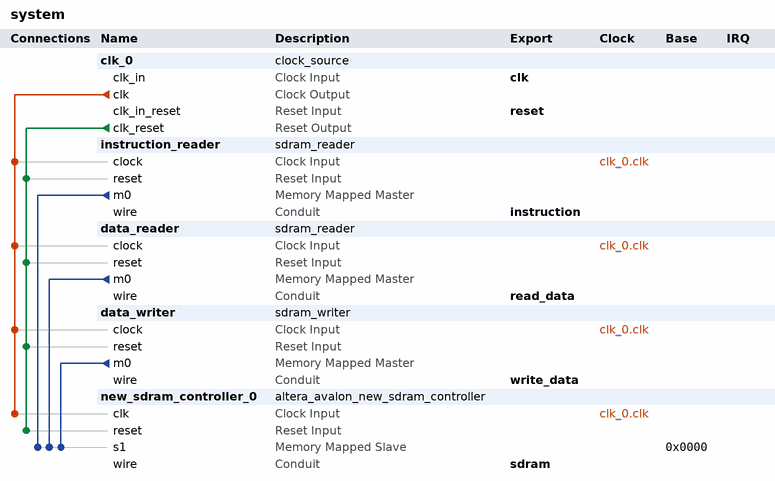
[diagram p0: system contents]
# Platform Designer (Qsys) system system, Cyclone IV E EP4CE22F17C6
# Parameters at their usual value, and those the tool derives, are not listed.
package require -exact qsys 15.1
create_system system
set_project_property DEVICE_FAMILY {Cyclone IV E}
set_project_property DEVICE EP4CE22F17C6

add_instance clk_0 clock_source 15.1
set_instance_parameter_value clk_0 clockFrequency 50000000

add_instance instruction_reader sdram_reader 1.0

add_instance data_reader sdram_reader 1.0

add_instance data_writer sdram_writer 1.0

add_instance new_sdram_controller_0 altera_avalon_new_sdram_controller 15.1
set_instance_parameter_value new_sdram_controller_0 TAC 5.5
set_instance_parameter_value new_sdram_controller_0 TRCD 20.0
set_instance_parameter_value new_sdram_controller_0 TRP 20.0
set_instance_parameter_value new_sdram_controller_0 casLatency 3
set_instance_parameter_value new_sdram_controller_0 columnWidth 9
set_instance_parameter_value new_sdram_controller_0 dataWidth 16
set_instance_parameter_value new_sdram_controller_0 generateSimulationModel false
set_instance_parameter_value new_sdram_controller_0 model single_Micron_MT48LC4M32B2_7_chip
set_instance_parameter_value new_sdram_controller_0 numberOfBanks 4
set_instance_parameter_value new_sdram_controller_0 numberOfChipSelects 1
set_instance_parameter_value new_sdram_controller_0 powerUpDelay 100.0
set_instance_parameter_value new_sdram_controller_0 refreshPeriod 15.625
set_instance_parameter_value new_sdram_controller_0 rowWidth 13

# connections
add_connection clk_0.clk data_reader.clock clock
add_connection clk_0.clk data_writer.clock clock
add_connection clk_0.clk instruction_reader.clock clock
add_connection clk_0.clk new_sdram_controller_0.clk clock
add_connection clk_0.clk_reset data_reader.reset reset
add_connection clk_0.clk_reset data_writer.reset reset
add_connection clk_0.clk_reset instruction_reader.reset reset
add_connection clk_0.clk_reset new_sdram_controller_0.reset reset
add_connection data_reader.m0 new_sdram_controller_0.s1 avalon
set_connection_parameter_value data_reader.m0/new_sdram_controller_0.s1 baseAddress 0x0000
add_connection data_writer.m0 new_sdram_controller_0.s1 avalon
set_connection_parameter_value data_writer.m0/new_sdram_controller_0.s1 baseAddress 0x0000
add_connection instruction_reader.m0 new_sdram_controller_0.s1 avalon
set_connection_parameter_value instruction_reader.m0/new_sdram_controller_0.s1 baseAddress 0x0000

# exported interfaces
add_interface clk clock sink
set_interface_property clk EXPORT_OF clk_0.clk_in
add_interface instruction conduit end
set_interface_property instruction EXPORT_OF instruction_reader.wire
add_interface read_data conduit end
set_interface_property read_data EXPORT_OF data_reader.wire
add_interface reset reset sink
set_interface_property reset EXPORT_OF clk_0.clk_in_reset
add_interface sdram conduit end
set_interface_property sdram EXPORT_OF new_sdram_controller_0.wire
add_interface write_data conduit end
set_interface_property write_data EXPORT_OF data_writer.wire

set_interconnect_requirement {$system} qsys_mm.clockCrossingAdapter AUTO
set_interconnect_requirement {$system} qsys_mm.insertDefaultSlave false
set_interconnect_requirement {$system} qsys_mm.maxAdditionalLatency 1

save_system system.qsys
